# EAGLE design altimeter (EAGLE 7.6.0)
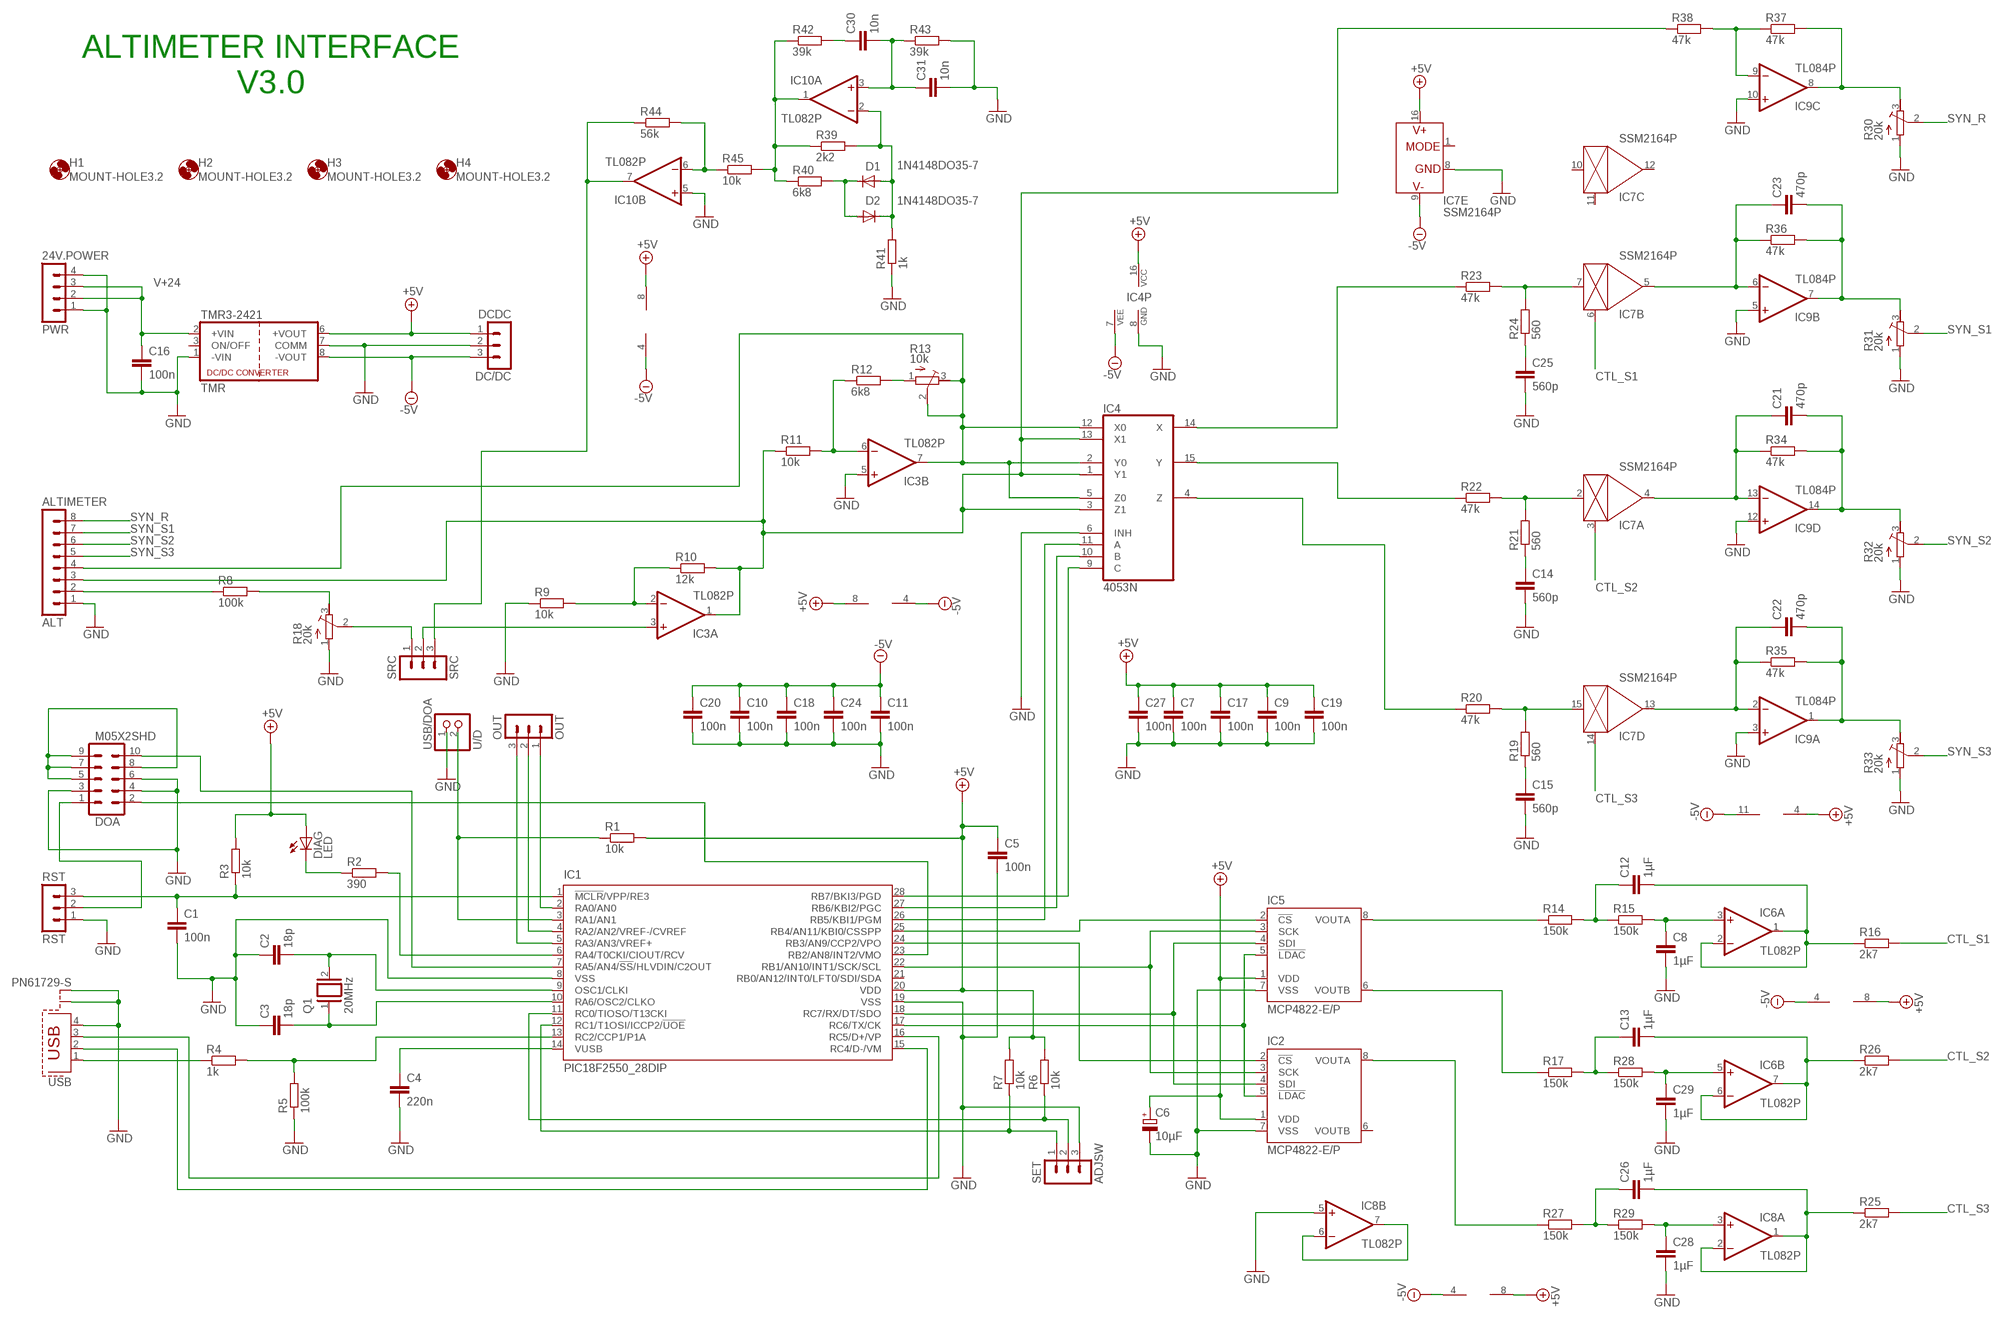
[diagram p0: schematic, sheet 1]

## Parts
24V.POWER  PWR  MA04-1  [MA04-1]
ADJSW  SET  MA03-1  [MA03-1]
ALTIMETER  ALT  MA08-1  [MA08-1]
C1  100n  C-EU025-025X050  [C025-025X050]
C2  18p  C-EU025-025X050  [C025-025X050]
C3  18p  C-EU025-025X050  [C025-025X050]
C4  220n  C5/3  [C5B3]
C5  100n  C-EU025-025X050  [C025-025X050]
C6  10µF  CPOL-EUE2.5-5  [E2,5-5]
C7  100n  C-EU025-025X050  [C025-025X050]
C8  1µF  C-EU025-025X050  [C025-025X050]
C9  100n  C-EU025-025X050  [C025-025X050]
C10  100n  C-EU025-025X050  [C025-025X050]
C11  100n  C-EU025-025X050  [C025-025X050]
C12  1µF  C-EU025-025X050  [C025-025X050]
C13  1µF  C-EU025-025X050  [C025-025X050]
C14  560p  C-EU025-025X050  [C025-025X050]
C15  560p  C-EU025-025X050  [C025-025X050]
C16  100n  C-EU025-025X050  [C025-025X050]
C17  100n  C-EU025-025X050  [C025-025X050]
C18  100n  C-EU025-025X050  [C025-025X050]
C19  100n  C-EU025-025X050  [C025-025X050]
C20  100n  C-EU025-025X050  [C025-025X050]
C21  470p  C-EU025-025X050  [C025-025X050]
C22  470p  C-EU025-025X050  [C025-025X050]
C23  470p  C-EU025-025X050  [C025-025X050]
C24  100n  C-EU025-025X050  [C025-025X050]
C25  560p  C-EU025-025X050  [C025-025X050]
C26  1µF  C-EU025-025X050  [C025-025X050]
C27  100n  C-EU025-025X050  [C025-025X050]
C28  1µF  C-EU025-025X050  [C025-025X050]
C29  1µF  C-EU025-025X050  [C025-025X050]
C30  10n  C-EU025-025X050  [C025-025X050]
C31  10n  C-EU025-025X050  [C025-025X050]
D1  1N4148DO35-7  [DO35-7]
D2  1N4148DO35-7  [DO35-7]
DC/DC  DCDC  MA03-1  [MA03-1]
DIAG  LED  LED3MM  [LED3MM]
DOA  M05X2SHD  [2X5-SHROUDED]
H1  MOUNT-HOLE3.2  [3,2]
H2  MOUNT-HOLE3.2  [3,2]
H3  MOUNT-HOLE3.2  [3,2]
H4  MOUNT-HOLE3.2  [3,2]
IC1  PIC18F2550_28DIP  [DIL28-3]
IC2  MCP4822-E/P  [DIL08]
IC3  TL082P  [DIL08]
IC4  4053N  [DIL16]
IC5  MCP4822-E/P  [DIL08]
IC6  TL082P  [DIL08]
IC7  SSM2164P  [DIL16]
IC8  TL082P  [DIL08]
IC9  TL084P  [DIL14]
IC10  TL082P  [DIL08]
OUT  OUT  MA03-1  [MA03-1]
Q1  20MHz  XTAL/S  [QS]
R1  10k  R-EU_0204/7  [0204/7]
R2  390  R-EU_0204/7  [0204/7]
R3  10k  R-EU_0204/7  [0204/7]
R4  1k  R-EU_0204/7  [0204/7]
R5  100k  R-EU_0204/7  [0204/7]
R6  10k  R-EU_0204/7  [0204/7]
R7  10k  R-EU_0204/7  [0204/7]
R8  100k  R-EU_0204/7  [0204/7]
R9  10k  R-EU_0204/7  [0204/7]
R10  12k  R-EU_0204/7  [0204/7]
R11  10k  R-EU_0204/7  [0204/7]
R12  6k8  R-EU_0204/7  [0204/7]
R13  10k  R-TRIMM64Z  [RTRIM64Z]
R14  150k  R-EU_0204/7  [0204/7]
R15  150k  R-EU_0204/7  [0204/7]
R16  2k7  R-EU_0204/7  [0204/7]
R17  150k  R-EU_0204/7  [0204/7]
R18  20k  R-TRIMM64Z  [RTRIM64Z]
R19  560  R-EU_0204/7  [0204/7]
R20  47k  R-EU_0204/7  [0204/7]
R21  560  R-EU_0204/7  [0204/7]
R22  47k  R-EU_0204/7  [0204/7]
R23  47k  R-EU_0204/7  [0204/7]
R24  560  R-EU_0204/7  [0204/7]
R25  2k7  R-EU_0204/7  [0204/7]
R26  2k7  R-EU_0204/7  [0204/7]
R27  150k  R-EU_0204/7  [0204/7]
R28  150k  R-EU_0204/7  [0204/7]
R29  150k  R-EU_0204/7  [0204/7]
R30  20k  R-TRIMM64Z  [RTRIM64Z]
R31  20k  R-TRIMM64Z  [RTRIM64Z]
R32  20k  R-TRIMM64Z  [RTRIM64Z]
R33  20k  R-TRIMM64Z  [RTRIM64Z]
R34  47k  R-EU_0204/7  [0204/7]
R35  47k  R-EU_0204/7  [0204/7]
R36  47k  R-EU_0204/7  [0204/7]
R37  47k  R-EU_0204/7  [0204/7]
R38  47k  R-EU_0204/7  [0204/7]
R39  2k2  R-EU_0204/7  [0204/7]
R40  6k8  R-EU_0204/7  [0204/7]
R41  1k  R-EU_0204/7  [0204/7]
R42  39k  R-EU_0204/7  [0204/7]
R43  39k  R-EU_0204/7  [0204/7]
R44  56k  R-EU_0204/7  [0204/7]
R45  10k  R-EU_0204/7  [0204/7]
RST  RST  MA03-1  [MA03-1]
SRC  SRC  MA03-1  [MA03-1]
TMR3-2421  TMR  [TRACO_SIP-8]
USB  PN61729-S  [PN61729-S]
USB/DOA  U/D  PINHD-1X2  [1X02]

## Nets
+5V [+5V]: C5.1 C6.+ C7.1 C9.1 C17.1 C19.1 C27.1 DC/DC.1 DIAG.A IC1.20(VDD) IC2.1(VDD) IC3.8(P:V+) IC4.16(VCC) IC5.1(VDD) IC6.8(P:V+) IC7.16(E:V+) IC8.8(P:V+) IC9.4(P:V+) IC10.8(P:V+) R1.2 R3.2 R6.2 R7.2 TMR3-2421.6(+VOUT)
-5V [-5V]: C10.1 C11.1 C18.1 C20.1 C24.1 DC/DC.3 IC3.4(P:V-) IC4.7(VEE) IC6.4(P:V-) IC7.9(E:V-) IC8.4(P:V-) IC9.11(P:V-) IC10.4(P:V-) TMR3-2421.8(-VOUT)
CTL_S1: IC7.6(B:CTRL) R16.2
CTL_S2: IC7.3(A:CTRL) R26.2
CTL_S3: IC7.14(D:CTRL) R25.2
GND [ground]: 24V.POWER.1 24V.POWER.4 ADJSW.3 ALTIMETER.1 C1.2 C2.1 C3.1 C4.2 C5.2 C6.- C7.2 C8.2 C9.2 C10.2 C11.2 C14.2 C15.2 C16.2 C17.2 C18.2 C19.2 C20.2 C24.2 C25.2 C27.2 C28.2 C29.2 C31.2 DC/DC.2 DOA.3 DOA.4 DOA.6 IC1.8(VSS) IC1.19(VSS) IC2.7(VSS) IC3.5(B:+IN) IC4.6(INH) IC4.8(GND) IC5.7(VSS) IC7.8(E:GND) IC8.5(B:+IN) IC9.3(A:+IN) IC9.5(B:+IN) IC9.10(C:+IN) IC9.12(D:+IN) IC10.5(B:+IN) R5.1 R9.1 R18.1(A) R30.1(A) R31.1(A) R32.1(A) R33.1(A) R41.1 R43.2 RST.1 TMR3-2421.1(-VIN) TMR3-2421.7(COMM) USB.4 USB.S1 USB.S2 USB/DOA.1
MUX_A: IC1.26(RB5/KBI1/PGM) IC4.11(A)
MUX_B: IC1.27(RB6/KBI2/PGC) IC4.10(B)
MUX_C: IC1.28(RB7/BKI3/PGD) IC4.9(C)
N$1: ALTIMETER.2 R8.1
N$2: IC5.8(VOUTA) R14.1
N$3: IC9.8(C:OUT) R30.3(E) R37.2
N$4: R8.2 R18.3(E)
N$5: IC5.6(VOUTB) R17.1
N$7: ADJSW.1 IC1.12(RC1/T1OSI/ICCP2/!UOE) R7.1
N$8: IC1.24(RB3/AN9/CCP2/VPO) IC2.2(!CS)
N$9: R12.2 R13.1(A)
N$10: IC3.2(A:-IN) R9.2 R10.1
N$11: IC9.9(C:-IN) R37.1 R38.2
N$12: R18.2(S) SRC.1
N$13: IC3.3(A:+IN) SRC.2
N$14: ADJSW.2 IC1.11(RC0/TIOSO/T13CKI) R6.1
N$15: IC1.25(RB4/AN11/KBI0/CSSPP) IC5.2(!CS)
N$16: C30.1 R42.2
N$17: IC10.6(B:-IN) R44.2 R45.1
N$18: IC1.2(RA0/AN0) OUT.1
N$19: IC3.6(B:-IN) R11.2 R12.1
N$20: IC1.4(RA2/AN2/VREF-/CVREF) OUT.2
N$21: IC1.5(RA3/AN3/VREF+) OUT.3
N$22: IC10.7(B:OUT) R44.1 SRC.3
N$23: C12.2 IC6.1(A:OUT) IC6.2(A:-IN) R16.1
N$24: IC1.17(RC6/TX/CK) IC2.5(!LDAC) IC5.5(!LDAC)
N$25: IC1.18(RC7/RX/DT/SDO) IC2.4(SDI) IC5.4(SDI)
N$26: IC10.1(A:OUT) R39.1 R40.1 R42.1 R45.2
N$27: ALTIMETER.4 IC3.7(B:OUT) IC4.2(Y0) IC4.5(Z0) IC4.12(X0) R13.2(S) R13.3(E)
N$28: C8.1 IC6.3(A:+IN) R15.2
N$29: C30.2 C31.1 IC10.3(A:+IN) R43.1
N$30: D1.C D2.A R40.2
N$31: C12.1 R14.2 R15.1
N$32: D1.A D2.C IC10.2(A:-IN) R39.2 R41.2
N$33: IC7.7(B:IN) R23.2 R24.2
N$34: C26.2 IC8.1(A:OUT) IC8.2(A:-IN) R25.1
N$35: IC7.2(A:IN) R21.2 R22.2
N$36: C28.1 IC8.3(A:+IN) R29.2
N$37: IC7.15(D:IN) R19.2 R20.2
N$38: C25.1 R24.1
N$39: C14.1 R21.1
N$40: C15.1 R19.1
N$41: C13.2 IC6.6(B:-IN) IC6.7(B:OUT) R26.1
N$42: C13.1 R17.2 R28.1
N$43: IC1.22(RB1/AN10/INT1/SCK/SCL) IC2.3(SCK) IC5.3(SCK)
N$44: C29.1 IC6.5(B:+IN) R28.2
N$45: C26.1 R27.2 R29.1
N$46: IC2.8(VOUTA) R27.1
N$47: IC8.6(B:-IN) IC8.7(B:OUT)
N$51: C4.1 IC1.14(VUSB)
N$54: IC1.16(RC5/D+/VP) USB.3
N$55: C23.1 IC7.5(B:OUT) IC9.6(B:-IN) R36.1
N$56: C23.2 IC9.7(B:OUT) R31.3(E) R36.2
N$57: C21.1 IC7.4(A:OUT) IC9.13(D:-IN) R34.1
N$58: C21.2 IC9.14(D:OUT) R32.3(E) R34.2
N$59: C22.1 IC7.13(D:OUT) IC9.2(A:-IN) R35.1
N$60: C22.2 IC9.1(A:OUT) R33.3(E) R35.2
N$61: IC1.15(RC4/D-/VM) USB.2
N$62: R4.1 USB.1
N$63: IC1.13(RC2/CCP1/P1A) R4.2 R5.2
N$64: DOA.1 RST.2
N$65: C3.2 IC1.10(RA6/OSC2/CLKO) Q1.1
N$66: C2.2 IC1.9(OSC1/CLKI) Q1.2
N$67: C1.1 IC1.1(!MCLR!/VPP/RE3) R3.1 RST.3
N$71 [+5V]: DOA.5 DOA.7 DOA.8 DOA.9
N$72: DOA.2 IC1.23(RB2/AN8/INT2/VMO)
N$73: DIAG.K(C) R2.1
N$74: IC1.6(RA4/T0CKI/CIOUT/RCV) R2.2
N$75: DOA.10 IC1.7(RA5/AN4/!SS!/HLVDIN/C2OUT)
N$76: IC1.3(RA1/AN1) R1.1 USB/DOA.2
REF_S1: IC4.14(X) R23.1
REF_S2: IC4.15(Y) R22.1
REF_S3: IC4.4(Z) R20.1
SIN: ALTIMETER.3 IC3.1(A:OUT) IC4.1(Y1) IC4.3(Z1) IC4.13(X1) R10.2 R11.1 R38.1
SYN_R: ALTIMETER.8 R30.2(S)
SYN_S1: ALTIMETER.7 R31.2(S)
SYN_S2: ALTIMETER.6 R32.2(S)
SYN_S3: ALTIMETER.5 R33.2(S)
V+24 [V+24]: 24V.POWER.2 24V.POWER.3 C16.1 TMR3-2421.2(+VIN)
Unconnected: IC1.21(RB0/AN12/INT0/LFT0/SDI/SDA) IC2.6(VOUTB) IC7.1(E:MODE) IC7.10(C:IN) IC7.11(C:CTRL) IC7.12(C:OUT) TMR3-2421.3(ON/OFF)

## Notes on the sheet
- ALTIMETER INTERFACE
  V3.0

## Library data of the parts
24V.POWER = con-lstb:MA04-1: PIN HEADER; OC_FARNELL: unknown; OC_NEWARK: unknown
ADJSW DC/DC OUT RST SRC = con-lstb:MA03-1: PIN HEADER; OC_FARNELL: unknown; OC_NEWARK: unknown
ALTIMETER = con-lstb:MA08-1: PIN HEADER; OC_FARNELL: unknown; OC_NEWARK: unknown
C1-C3 C5 C7-C31 = rcl:C-EU: CAPACITOR, European symbol
C4 = capacitor-wima:C: CAPACITOR naming: grid - package width
C6 = rcl:CPOL-EU: POLARIZED CAPACITOR, European symbol
D1 D2 = diode:1N4148: DIODE high speed (Philips)
DIAG = henk:LED: LEDs Standard schematic elements and footprints for 5mm, 3mm, 1206, and 0603 sized LEDs. 5mm - Spark Fun Electronics SKU : COM-00529 (and others)
DOA = henk:M05X2: Header 5x2 Standard 10-pin dual row 0.1" header. Commonly used with AVR-ISP. Use with Spark Fun Electronics SKU: PRT-00778
H1-H4 = holes:MOUNT-HOLE: MOUNTING HOLE with drill center marker
IC1 = microchip:PIC18F2*_28: USB Microcontrollers with nanoWatt Technology High-Performance, Enhanced Flash, 28/40/44-Pin, Source: http://ww1.microchip.com/downloads/en/devicedoc/39632c.pdf; MF: MICROCHIP; MPN: PIC18F2550-I/SP; OC_FARNELL: 1523822; OC_NEWARK: 80K6054
IC2 IC5 = nh-ic:MCP4822: Microchip MCP4822 According to datasheet http://ww1.microchip.com/downloads/en/DeviceDoc/22249A.pdf. Created by Nils Hintze <n.hintze@elektronikpage.net>
IC3 IC6 IC8 IC10 = linear:TL082: OP AMP Data sheet <http://www.ti.com/lit/ds/symlink/tl084a . pdf>; DATA_SHEET: <a href="http://www.ti.com/lit/ds/symlink/tl084a.pdf"> Data sheet </a>
IC4 = 40xx:4053: Triple 2-channel ANALOG MULTIPLEXER
IC7 = ssm2164:SSM2164
IC9 = linear:TL084: OP AMP
Q1 = special:XTAL/S: CRYSTAL
R1-R12 R14-R17 R19-R29 R34-R45 = rcl:R-EU_: RESISTOR, European symbol
R13 R18 R30-R33 = resistor:R-TRIMM: Trimm resistor
TMR3-2421 = traco-tmr-dual:TMR
USB = con-berg:PN61729-S: BERG USB connector; OC_FARNELL: unknown; OC_NEWARK: unknown
USB/DOA = pinhead:PINHD-1X2: PIN HEADER

## Net classes
0 default: width 0.254 mm, clearance 0.381 mm
1 ground: width 0.508 mm, clearance 0.381 mm
2 +5V: width 0.508 mm, clearance 0.381 mm
3 -5V: width 0.508 mm, clearance 0.381 mm
4 V-15: width 0.508 mm, clearance 0.381 mm
5 V+15: width 0.508 mm, clearance 0.381 mm
6 V+24: width 0.508 mm, clearance 0.381 mm

## Board
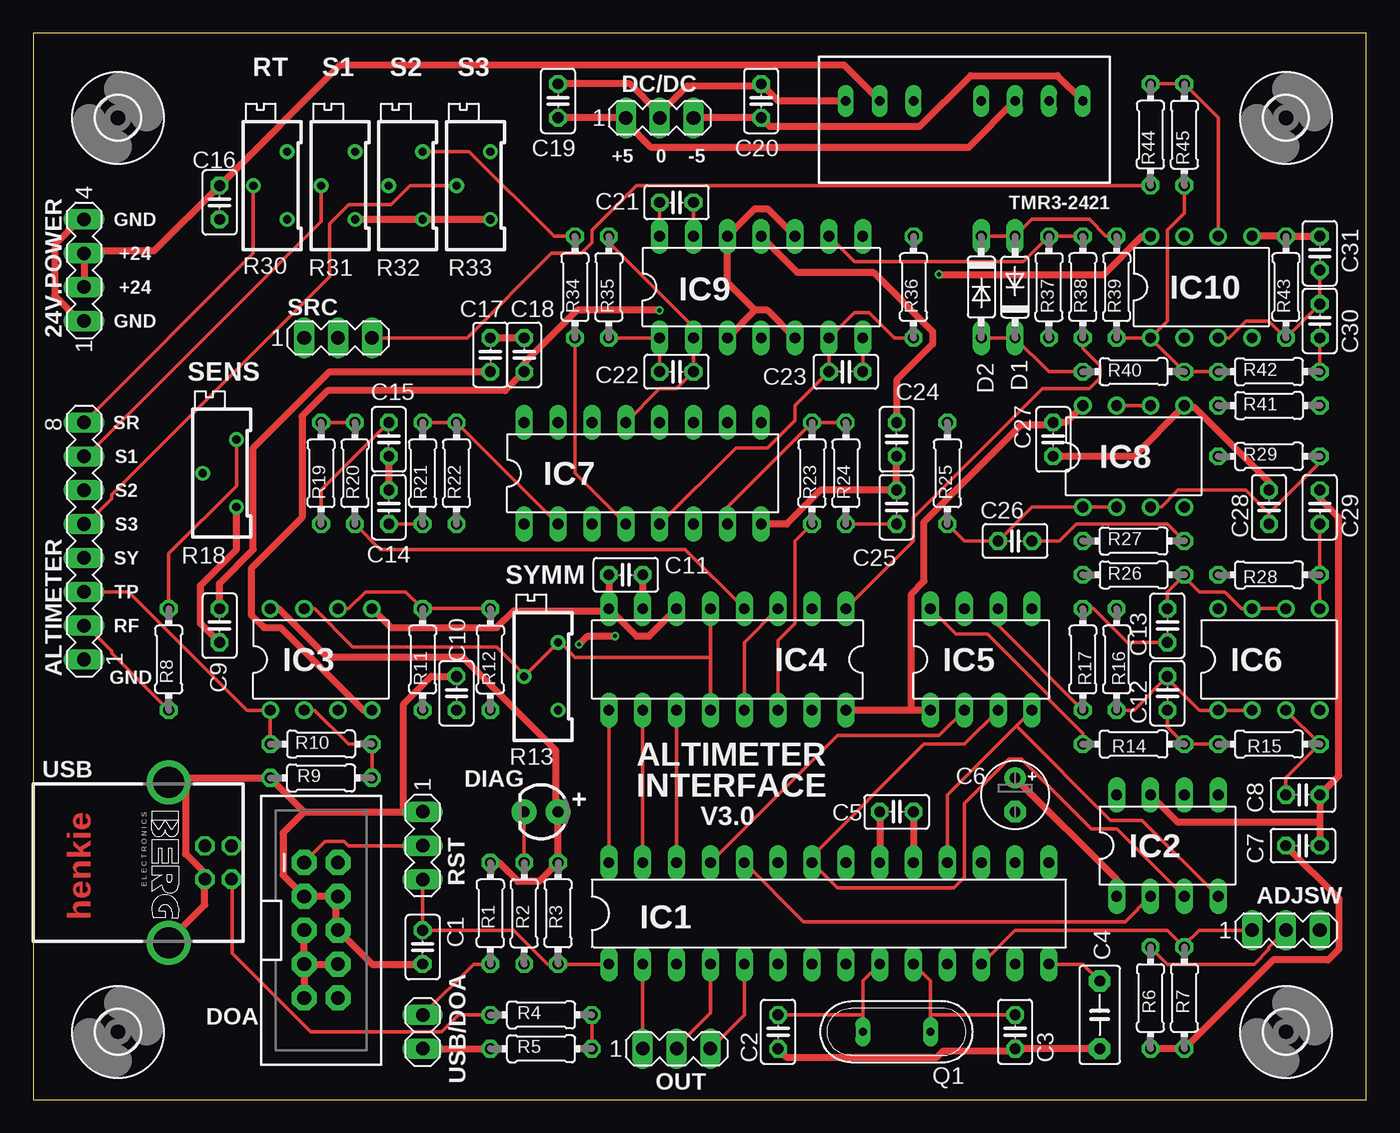
[diagram p1: board, top side]
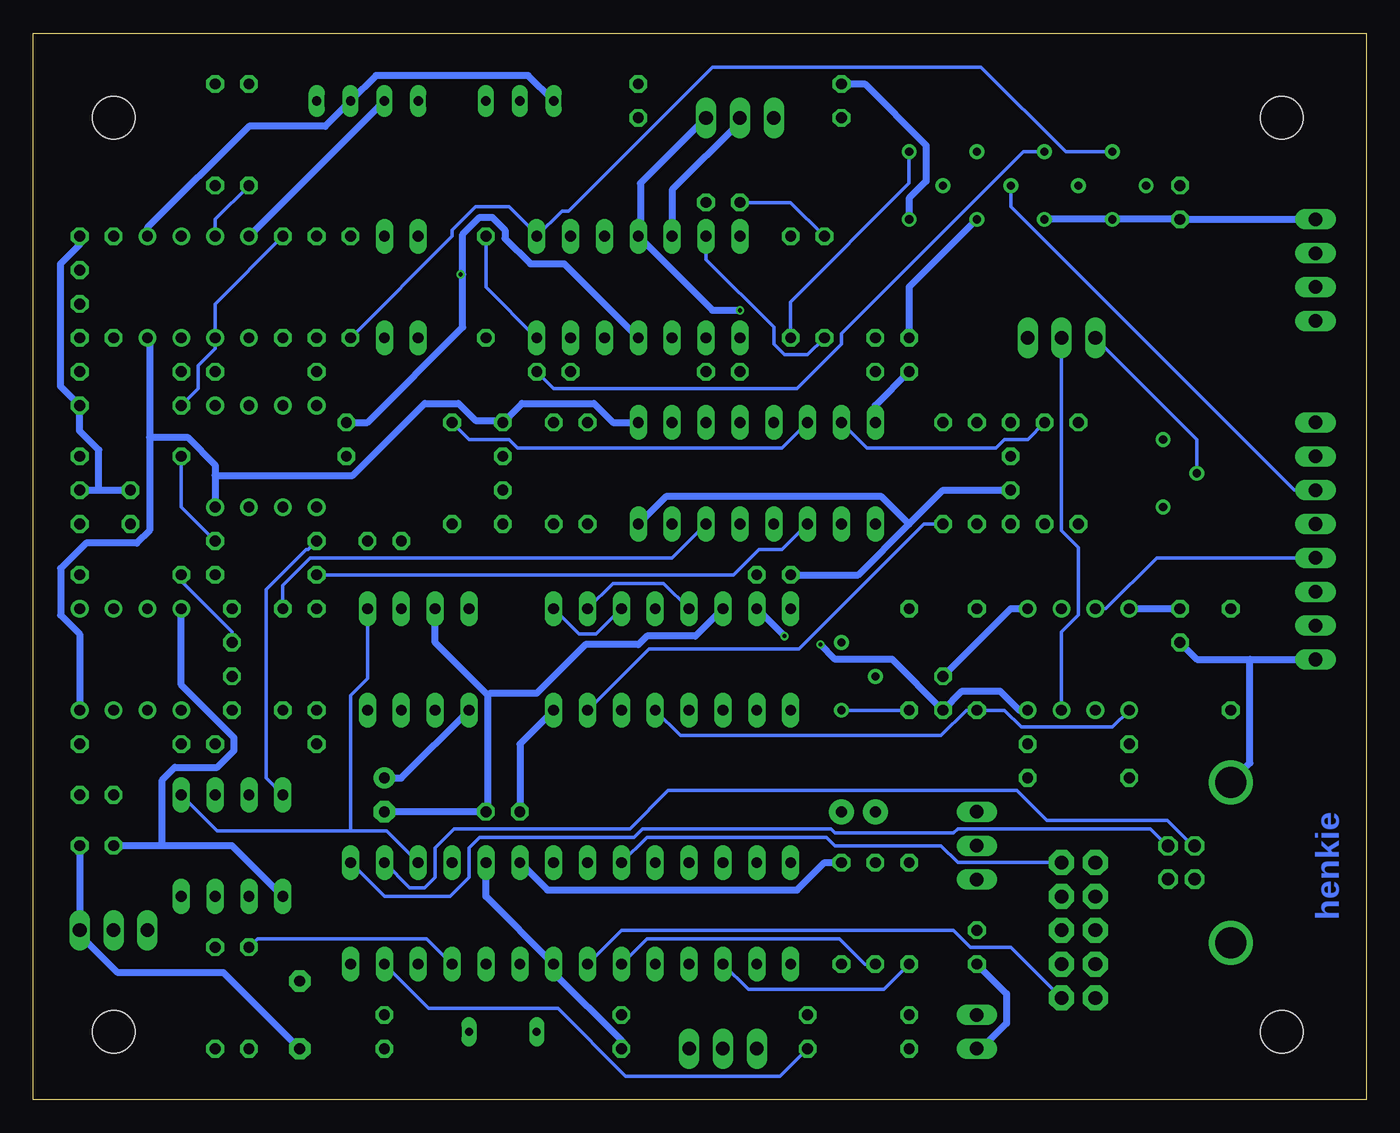
[diagram p2: board, bottom side, seen from below]

Size 100 x 80 mm. Coordinates in mm from the lower left corner, seen from the top.
Outline: 0,0 100,0 100,80 0,80 0,0
Copper layers (1*16): Top 0.035mm / dielectric 1.5mm / Bottom 0.035mm
Design rules "ITEADstudio_DRC": minimum track width 6mil, minimum drill 12mil, track to track 6mil, track to pad 6mil, pad to pad 6mil, via to via 6mil, smd to smd 0mil, copper to edge 10mil, drill to drill 10mil, minimum pad ring 10mil, minimum via ring 6mil, stop-mask expansion 2mil, vias tented up to drill 100mil, thermal gap 10mil

### Footprints (pad centres in the part's own frame; a part is rotated, then mirrored left to right if it is on the bottom)
MA04-1 = drill 1.016 long: 1 -3.81,0; 2 -1.27,0; 3 1.27,0; 4 3.81,0
MA03-1 = drill 1.016 long: 1 -2.54,0; 2 0,0; 3 2.54,0
MA08-1 = drill 1.016 long: 1 -8.89,0; 2 -6.35,0; 3 -3.81,0; 4 -1.27,0; 5 1.27,0; 6 3.81,0; 7 6.35,0; 8 8.89,0
C025-025X050 = drill 0.813 octagon: 1 -1.27,0; 2 1.27,0
C5B3 = drill 0.813 pad 1.6 octagon: 1 -2.54,0; 2 2.54,0
E2,5-5 = drill 0.813 pad 1.6: + -1.27,0 | drill 0.813 pad 1.6 octagon: - 1.27,0
DO35-7 = drill 0.813 long: A 3.81,0; C -3.81,0
LED3MM = drill 0.813 pad 1.88: A -1.27,0; K 1.27,0
2X5-SHROUDED = drill 1.016 pad 1.88 octagon: 1 -1.27,5.08; 2 1.27,5.08; 3 -1.27,2.54; 4 1.27,2.54; 5 -1.27,0; 6 1.27,0; 7 -1.27,-2.54; 8 1.27,-2.54; 9 -1.27,-5.08; 10 1.27,-5.08
3,2 = hole 3.2: 0,0
DIL28-3 = drill 0.813 long: 1 -16.51,-3.81; 2 -13.97,-3.81; 3 -11.43,-3.81; 4 -8.89,-3.81; 5 -6.35,-3.81; 6 -3.81,-3.81; 7 -1.27,-3.81; 8 1.27,-3.81; 9 3.81,-3.81; 10 6.35,-3.81; 11 8.89,-3.81; 12 11.43,-3.81; 13 13.97,-3.81; 14 16.51,-3.81; 15 16.51,3.81; 16 13.97,3.81; 17 11.43,3.81; 18 8.89,3.81; 19 6.35,3.81; 20 3.81,3.81; 21 1.27,3.81; 22 -1.27,3.81; 23 -3.81,3.81; 24 -6.35,3.81; 25 -8.89,3.81; 26 -11.43,3.81; 27 -13.97,3.81; 28 -16.51,3.81
DIL08 = drill 0.813 long: 1 -3.81,-3.81; 2 -1.27,-3.81; 3 1.27,-3.81; 4 3.81,-3.81; 5 3.81,3.81; 6 1.27,3.81; 7 -1.27,3.81; 8 -3.81,3.81
DIL08' = drill 0.813 pad 1.27: 1 -3.81,-3.81; 2 -1.27,-3.81; 3 1.27,-3.81; 4 3.81,-3.81; 5 3.81,3.81; 6 1.27,3.81; 7 -1.27,3.81; 8 -3.81,3.81
DIL16 = drill 0.813 long: 1 -8.89,-3.81; 2 -6.35,-3.81; 3 -3.81,-3.81; 4 -1.27,-3.81; 5 1.27,-3.81; 6 3.81,-3.81; 7 6.35,-3.81; 8 8.89,-3.81; 9 8.89,3.81; 10 6.35,3.81; 11 3.81,3.81; 12 1.27,3.81; 13 -1.27,3.81; 14 -3.81,3.81; 15 -6.35,3.81; 16 -8.89,3.81
DIL14 = drill 0.813 long: 1 -7.62,-3.81; 2 -5.08,-3.81; 3 -2.54,-3.81; 4 0,-3.81; 5 2.54,-3.81; 6 5.08,-3.81; 7 7.62,-3.81; 8 7.62,3.81; 9 5.08,3.81; 10 2.54,3.81; 11 0,3.81; 12 -2.54,3.81; 13 -5.08,3.81; 14 -7.62,3.81
QS = drill 0.61 long: 1 -2.54,0; 2 2.54,0
0204/7 = drill 0.813 octagon: 1 -3.81,0; 2 3.81,0
RTRIM64Z = drill 0.61: 1 0,-2.54; 2 -2.54,0; 3 0,2.54
TRACO_SIP-8 = drill 0.7 long: 1 -8.89,0; 2 -6.35,0; 3 -3.81,0; 5 1.27,0; 6 3.81,0; 7 6.35,0; 8 8.89,0
PN61729-S = drill 0.95 octagon: 1 1.25,4.71; 2 -1.25,4.71; 3 -1.25,2.71; 4 1.25,2.71 | drill 2.3 pad 2.9: S1 -6.02,0; S2 6.02,0
1X02 = drill 1.016 long: 1 -1.27,0; 2 1.27,0

### Placement (x,y rotation side)
24V.POWER  3.81,62.23 90 top
ADJSW  93.98,12.7 0 top
ALTIMETER  3.81,41.91 90 top
C1  29.21,11.43 270 top
C2  55.88,5.08 90 top
C3  73.66,5.08 90 top
C4  80.01,6.35 270 top
C5  64.77,21.59 0 top
C6  73.66,22.86 270 top
C7  95.25,19.05 0 top
C8  95.25,22.86 0 top
C9  13.97,35.56 270 top
C10  31.75,30.48 90 top
C11  44.45,39.37 180 top
C12  85.09,30.48 90 top
C13  85.09,35.56 90 top
C14  26.67,44.45 90 top
C15  26.67,49.53 270 top
C16  13.97,67.31 270 top
C17  34.29,55.88 90 top
C18  36.83,55.88 90 top
C19  39.37,74.93 90 top
C20  54.61,74.93 90 top
C21  48.26,67.31 180 top
C22  48.26,54.61 180 top
C23  60.96,54.61 0 top
C24  64.77,49.53 270 top
C25  64.77,44.45 90 top
C26  73.66,41.91 180 top
C27  76.52,49.53 270 top
C28  92.71,44.45 90 top
C29  96.52,44.45 90 top
C30  96.52,58.42 90 top
C31  96.52,63.5 90 top
D1  73.66,60.96 90 top
D2  71.12,60.96 270 top
DC/DC  46.99,73.66 0 top
DIAG  38.1,21.59 180 top
DOA  21.59,12.7 0 top
H1  6.35,73.66 0 top
H2  93.98,5.08 0 top
H3  6.35,5.08 0 top
H4  93.98,73.66 0 top
IC1  59.69,13.97 0 top
IC2  85.09,19.05 0 top
IC3  TL082P  [DIL08']  21.59,33.02 0 top
IC4  52.07,33.02 180 top
IC5  71.12,33.02 0 top
IC6  TL082P  [DIL08']  92.71,33.02 0 top
IC7  45.72,46.99 0 top
IC8  TL082P  [DIL08']  82.55,48.26 0 top
IC9  54.61,60.96 0 top
IC10  TL082P  [DIL08']  87.63,60.96 0 top
OUT  48.26,3.81 0 top
Q1  64.77,5.08 180 top
R1  34.29,13.97 90 top
R2  36.83,13.97 270 top
R3  39.37,13.97 90 top
R4  38.1,6.35 0 top
R5  38.1,3.81 0 top
R6  83.82,7.62 270 top
R7  86.36,7.62 270 top
R8  10.16,33.02 90 top
R9  21.59,24.13 0 top
R10  21.59,26.67 180 top
R11  29.21,33.02 90 top
R12  34.29,33.02 270 top
R13  39.37,31.75 0 top
R14  82.55,26.67 0 top
R15  92.71,26.67 0 top
R16  81.28,33.02 90 top
R17  78.74,33.02 90 top
R18  15.24,46.99 0 top
R19  21.59,46.99 90 top
R20  24.13,46.99 90 top
R21  29.21,46.99 90 top
R22  31.75,46.99 90 top
R23  58.42,46.99 90 top
R24  60.96,46.99 90 top
R25  68.58,46.99 90 top
R26  82.55,39.37 180 top
R27  82.55,41.91 0 top
R28  92.71,39.37 0 top
R29  92.71,48.26 0 top
R30  19.05,68.58 0 top
R31  24.13,68.58 0 top
R32  29.21,68.58 0 top
R33  34.29,68.58 0 top
R34  40.64,60.96 90 top
R35  43.18,60.96 270 top
R36  66.04,60.96 90 top
R37  76.2,60.96 270 top
R38  78.74,60.96 90 top
R39  81.28,60.96 90 top
R40  82.55,54.61 180 top
R41  92.71,52.07 180 top
R42  92.71,54.61 0 top
R43  93.98,60.96 90 top
R44  83.82,72.39 90 top
R45  86.36,72.39 270 top
RST  29.21,19.05 270 top
SRC  22.86,57.15 0 top
TMR3-2421  69.85,74.93 0 top
USB  10.16,17.78 270 top
USB/DOA  29.21,5.08 90 top

### Tracks (layer width: path | path; a pad name or v marks a point on that pad's centre or on a via)
+5V  (via drill 0.3)
  Top 0.508: R1.2 34.92,17.78 36.35,16.35 37.94,16.35 R3.2 DIAG.A 39.21,21.75 39.21,26.19 32.23,33.18 22.07,33.18 18.41,36.83 IC3.8 | C17.1 22.23,54.61 16.51,48.9 16.51,41.27 13.97,38.73 C9.1 | C19.1 DC/DC.1 44.61,73.5 44.61,73.18 46.35,71.44 70.17,71.44 TMR3-2421.6 | IC8.8 77.47,50.8 C27.1 76.36,50.64 74.14,50.64 66.83,43.34 66.83,38.89 65.88,37.94 65.88,29.21 | C5.1 IC1.20 | IC5.1 65.88,29.21 | 65.88,29.21 IC4.16 | R6.2 R7.2 93.03,10.48 97.16,10.48 97.95,11.27 97.95,15.08 C7.1 | IC2.1 81.28,16.51 C6.+ | IC10.8 83.19,64.77 80.33,61.91 v67.94,61.91
  Bottom 0.508: IC7.16 36.83,52.07 C17.1 | IC3.8 C9.1 | IC10.8 TMR3-2421.6 | IC9.4 60.17,62.71 62.71,62.71 64.61,64.61 64.61,65.25 65.56,66.2 66.52,66.2 67.79,64.93 67.79,61.91 | 67.79,61.91 67.79,57.94 74.93,50.8 C27.1 | C5.1 63.5,26.67 IC4.16 | 90.33,19.05 85.09,19.05 IC2.1 | 90.33,19.05 C7.1 | IC6.8 88.9,31.11 84.93,27.15 84.93,26.19 86.2,24.92 89.38,24.92 90.33,23.97 90.33,19.05 | IC5.1 72.39,24.13 C6.+ | v67.94,61.91 67.79,61.91 | R3.2 40.64,17.78 42.7,15.72 61.44,15.72 IC1.20
-5V  (via drill 0.3)
  Top 0.508: C11.1 IC4.7 | v43.66,34.77 41.59,34.77 v40.96,34.13 | v46.99,59.21 40.8,59.21 36.83,55.24 C18.1 35.4,53.18 22.07,53.18 20.16,51.28 20.16,43.66 16.35,39.85 16.35,36.35 17.3,35.4 18.57,35.4 24.77,29.21 IC3.4 | TMR3-2421.8 76.83,76.83 70.33,76.83 66.52,73.03 55.24,73.03 C20.1 DC/DC.3 | C24.1 64.77,53.98 67.47,56.67 67.47,57.63 63.02,62.07 57.31,62.07 IC9.11
  Bottom 0.508: IC7.9 56.52,50.8 57.94,52.23 63.34,52.23 C24.1 64.93,50.96 66.83,50.96 68.1,52.23 70.64,52.23 76.04,46.83 86.36,46.83 | IC6.4 96.52,34.92 97.95,36.35 97.95,39.85 96.04,41.75 92.23,41.75 91.28,42.7 91.28,49.69 | 91.28,49.69 91.28,56.99 IC10.4 | 86.36,46.83 86.36,47.62 88.42,49.69 91.28,49.69 | 86.36,46.83 IC8.4 | IC3.4 26.04,29.21 27.46,30.64 30.32,30.64 C10.1 35.56,33.02 39.85,33.02 v40.96,34.13 | v43.66,34.77 IC4.7 | v46.99,59.21 49.05,59.21 IC9.11 54.45,64.93 54.45,68.74 DC/DC.3
CTL_S1
  Bottom 0.254: R16.2 81.28,38.58 79.22,40.64 52.07,40.64 IC7.6
CTL_S2
  Bottom 0.254: R26.2 47.47,39.37 45.56,41.27 43.81,41.27 IC7.3
CTL_S3
  Bottom 0.254: IC7.14 43.81,48.9 63.66,48.9 64.29,49.53 67.31,49.53 R25.2
GND
  Top 0.508: 24V.POWER.1 3.49,58.42 1.59,60.33 1.59,64.14 3.49,66.04 24V.POWER.4 | C18.2 C17.2 | R31.1 R32.1 R33.1 | C27.2 82.55,48.26 IC8.5 86.52,51.91 87.15,51.91 92.71,46.35 C28.2 | IC10.5 R43.2 C31.2 | 54.13,59.21 IC9.3 | 54.13,59.21 55.09,59.21 IC9.5 | 54.13,59.21 52.07,61.28 IC9.12 54.13,66.83 55.09,66.83 IC9.10 | C19.2 44.77,76.2 46.99,73.98 DC/DC.2 47.15,74.14 49.05,76.04 54.45,76.04 C20.2 55.88,74.93 TMR3-2421.1 | C5.2 IC1.19 | 96.52,20.8 C8.2 97.95,24.29 97.95,43.66 96.52,45.09 C29.2 | 96.52,20.8 C7.2 | IC2.7 85.88,20.8 96.52,20.8 | C4.2 C3.1 73.5,3.65 68.26,3.65 67.79,3.17 56.52,3.17 C2.1 | IC7.8 56.52,43.18 59.05,45.72 C25.2 C24.2 | C15.2 C14.2 | C11.2 IC4.8 | IC4.6 46.2,34.77 45.24,34.77 IC4.8 | USB/DOA.1 R5.1 | C1.2 25.4,10.16 DOA.6 22.7,12.86 22.7,15.08 DOA.4 DOA.3 18.73,16.83 18.73,20 20.32,21.59 | R18.1 15.24,41.27 12.54,38.58 12.54,35.72 C9.2 | USB.S2 10.16,11.91 12.86,14.61 12.86,16.51 USB.4 12.7,16.67 12.7,17.14 11.43,18.41 11.43,23.97 USB.S1 10.16,23.81 10.48,24.13 R9.1 20.32,21.59 | 20.32,21.59 RST.1 27.78,21.75 27.78,29.69 29.84,31.75 C10.2 | IC3.5 26.83,35.4 34.77,35.4 36.04,36.67 43.02,36.67 IC4.8
  Bottom 0.508: R31.1 R30.1 C16.2 24V.POWER.4 | C17.2 34.29,60.96 R32.1 | C29.2 95.09,45.72 | 95.09,45.72 C28.2 | 95.09,45.72 95.09,48.74 96.52,50.16 R41.1 97.95,53.5 97.95,62.71 96.52,64.14 C31.2 | TMR3-2421.1 62.87,76.83 74.3,76.83 TMR3-2421.7 78.11,73.03 83.82,73.03 91.44,65.41 IC10.5 | IC9.12 52.07,68.26 46.99,73.34 DC/DC.2 | R33.1 34.29,67.63 33.02,68.9 33.02,71.6 37.62,76.2 C19.2 | IC5.7 69.85,34.29 65.88,30.32 | 65.88,30.32 65.88,21.75 C5.2 C6.- | C7.2 ADJSW.3 96.36,12.54 96.36,12.22 93.66,9.53 85.72,9.53 C4.2 | C2.1 55.88,4.45 60.96,9.53 IC1.8 66.04,15.24 IC1.19 | C14.2 31.75,45.72 34.29,43.18 | 34.29,43.18 38.1,39.37 C11.2 | IC7.8 52.55,45.24 36.35,45.24 34.29,43.18 | USB/DOA.1 28.89,3.81 26.99,5.71 26.99,7.94 C1.2 | 8.73,33.02 12.7,33.02 C9.2 | 8.73,33.02 ALTIMETER.1 | IC3.5 26.67,36.83 C10.2 | 8.73,33.02 8.73,25.24 10.16,23.81 USB.S1 | IC4.6 50.32,34.77 53.98,34.77 54.61,34.13 58.58,34.13 62.23,30.48 65.72,30.48 65.88,30.32
MUX_A
  Top 0.254: IC4.11 IC1.26
MUX_B
  Top 0.254: IC4.10 IC1.27
MUX_C
  Top 0.254: IC4.9 IC1.28
N$1
  Top 0.254: R8.1 5.87,33.5 5.87,33.66 3.97,35.56 ALTIMETER.2
N$2
  Top 0.254: R14.1 78.74,27.46 76.2,30 76.2,30.32 71.6,34.92 69.22,34.92 IC5.8
N$3
  Bottom 0.254: R30.3 22.54,71.12 28.89,77.47 49.05,77.47 59.85,66.67 60.33,66.67 IC9.8 62.23,64.93 64.29,66.99 66.83,66.99 68.58,65.25 68.58,64.77 R37.2
N$4
  Top 0.254: R18.3 15.24,46.04 10.16,40.96 R8.2
N$5
  Top 0.254: IC5.6 72.39,35.56 R17.1
N$7
  Top 0.254: IC1.12 73.66,12.7 85.09,12.7 R7.1 86.36,11.59 87.47,12.7 ADJSW.1
N$8
  Top 0.254: IC2.2 81.92,13.34 57.78,13.34 IC1.24
N$9
  Bottom 0.254: R12.2 R13.1
N$10
  Top 0.254: R9.2 R10.1 23.65,26.67 21.11,29.21 IC3.2
N$11
  Top 0.254: IC9.9 61.59,62.87 74.3,62.87 R37.1 R38.2
N$12
  Bottom 0.254: R18.2 12.7,49.53 SRC.1
N$13
  Bottom 0.254: IC3.3 22.86,35.08 21.59,36.35 21.59,41.43 22.86,42.7 SRC.2
N$14
  Top 0.254: ADJSW.2 92.71,11.43 92.71,11.27 91.6,10.16 85.09,10.16 R6.1
  Bottom 0.254: IC1.11 70.48,12.06 83.19,12.06 R6.1
N$15
  Top 0.254: IC1.25 60.33,27.3 67.94,27.3 IC5.2
N$16
  Top 0.254: C30.1 R42.2
N$17
  Top 0.254: R44.2 R45.1 88.9,73.66 IC10.6
N$18
  Top 0.254: OUT.1 IC1.2
N$19
  Top 0.254: IC3.6 23.65,36.83 24.92,38.1 27.94,38.1 R11.2 R12.1
N$20
  Top 0.254: IC1.4 50.8,6.51 48.26,3.97 OUT.2
N$21
  Top 0.254: IC1.5 53.34,6.35 OUT.3
N$22
  Top 0.254: SRC.3 32.54,57.15 38.89,63.5 41.12,63.5 41.91,64.29 41.91,65.25 45.24,68.58 R44.1
  Bottom 0.254: IC10.7 86.36,66.04 R44.1
N$23
  Top 0.254: IC6.2 IC6.1 87.47,29.21 85.09,31.59 C12.2 82.55,29.21 R16.1
N$24
  Bottom 0.254: IC1.17 73.5,20.16 76.2,20.16 | 76.2,20.16 86.2,20.16 IC2.5 | IC5.5 74.93,31.59 76.2,30.32 76.2,20.16
N$25
  Top 0.254: IC1.18 68.58,22.86 73.74,28.02 | IC5.4 73.74,28.02 | IC2.4 83.19,20.95 80.8,20.95 73.74,28.02
N$26
  Top 0.254: R42.1 R40.1 IC10.1 | IC10.1 R39.1 | R45.2 86.36,66.52 85.09,65.25 85.09,58.42 IC10.1
N$27
  Top 0.254: IC4.5 50.8,33.18 | 50.8,33.18 IC4.12 | 50.8,33.18 40.64,33.18 39.69,34.13 39.37,34.13 R13.3 R13.2 36.83,31.91 34.77,33.97 23.97,33.97 21.11,36.83 IC3.7
  Bottom 0.254: IC3.7 19.53,36.83 15.72,40.64 ALTIMETER.4 | IC4.2 56.52,38.73 52.7,38.73 IC4.5
N$28
  Top 0.254: C8.1 93.98,24.13 R15.2 IC6.3
N$29
  Top 0.254: C31.1 C30.2 R43.1 92.71,58.42 90.96,58.42 89.69,57.15 IC10.3
N$30
  Top 0.254: D2.A D1.C 76.2,54.61 R40.2
N$31
  Top 0.254: R15.1 R14.2 85.09,27.94 C12.1
N$32
  Top 0.254: D2.C D1.A 74.93,66.04 79.22,66.04 80.49,64.77 R39.2
  Bottom 0.254: R41.2 87.63,53.34 87.63,55.09 86.36,56.36 IC10.2 86.36,59.69 R39.2
N$33
  Top 0.254: IC7.7 52.07,44.45 R23.2 R24.2
N$34
  Top 0.254: IC8.2 IC8.1 74.93,44.45 C26.2 69.85,41.91 R25.1
N$35
  Top 0.254: IC7.2 R22.2 R21.2
N$36
  Top 0.254: 92.71,43.97 C28.1 | 92.71,43.97 96.52,47.78 R29.2 | IC8.3 84.61,44.45 85.88,45.72 90.96,45.72 92.71,43.97
N$37
  Top 0.254: R20.2 R19.2
  Bottom 0.254: IC7.15 37.47,48.9 27.78,48.9 27.15,49.53 25.4,49.53 R20.2
N$38
  Top 0.254: C25.1 R24.1
N$39
  Top 0.254: R21.1 C14.1
N$40
  Top 0.254: R19.1 21.59,45.72 C15.1
N$41
  Top 0.254: IC6.6 IC6.7 90.65,36.83 89.38,38.1 87.47,38.1 86.36,39.21 R26.1 85.09,38.1 C13.2
N$42
  Top 0.254: R17.2 79.53,36.83 82.07,34.29 C13.1
  Bottom 0.254: C13.1 85.09,35.08 88.9,38.89 R28.1
N$43
  Top 0.254: IC5.3 69.85,26.67 66.83,26.67 58.42,18.26 IC1.22 60.33,15.88 69.06,15.88 69.85,16.67 69.85,22.23 73.18,25.56 74.14,25.56 79.38,20.32 81.28,20.32 IC2.3
N$44
  Top 0.254: IC6.5 R28.2 C29.1
N$45
  Top 0.254: C26.1 76.99,41.91 78.26,43.18 85.09,43.18 R27.2
  Bottom 0.254: R29.1 88.9,44.45 R27.2
N$46
  Bottom 0.254: R27.1 79.38,41.27 79.53,41.27 82.55,38.26 82.55,24.13 IC2.8
N$47
  Top 0.254: IC8.6 IC8.7
N$51
  Top 0.254: IC1.14 78.74,10.16 C4.1
N$54
  Bottom 0.254: IC1.16 71.75,15.88 70.64,15.88 69.85,16.67 69.85,18.89 68.42,20.32 55.24,20.32 52.39,23.18 26.19,23.18 23.97,20.95 14.92,20.95 13.02,19.05 USB.3
N$55
  Top 0.254: IC7.5 52.7,48.9 55.09,48.9 57.15,50.96 57.15,52.07 C23.1 IC9.6 61.59,59.05 62.71,59.05 64.61,57.15 R36.1
N$56
  Top 0.254: C23.2 IC9.7
  Bottom 0.254: R31.3 25.72,71.12 39.37,57.47 39.37,56.67 42.7,53.34 60.96,53.34 C23.2 | R36.2 66.04,60.96 IC9.7
N$57
  Top 0.254: C21.1 IC9.13 | R34.1 40.64,46.99 IC7.4
  Bottom 0.254: IC9.13 49.53,63.02 44.45,57.94 44.45,56.67 43.66,55.88 41.91,55.88 R34.1
N$58
  Top 0.254: C21.2 IC9.14 | R32.3 32.7,71.12 39.05,64.77 R34.2
  Bottom 0.254: C21.2 43.18,67.31 R34.2
N$59
  Top 0.254: IC7.13 46.99,53.34 48.26,53.34 C22.1 IC9.2 49.53,57.94 43.18,64.29 R35.1
N$60
  Top 0.254: C22.2 IC9.1 R35.2
  Bottom 0.254: R33.3 34.29,68.74 43.18,59.85 R35.2
N$61
  Bottom 0.254: IC1.15 73.66,15.24 68.74,15.24 67.31,16.67 67.31,18.89 66.52,19.68 54.93,19.68 54.29,20.32 40.16,20.32 39.85,20 30.96,20 30.64,20.32 16.19,20.32 14.92,19.05 USB.2
N$62
  Top 0.254: R4.1 31.91,6.35 30.64,5.08 20.8,5.08 14.92,10.95 14.92,16.51 USB.1
N$63
  Top 0.254: R4.2 R5.2
  Bottom 0.254: IC1.13 70.33,6.83 60.64,6.83 55.56,1.75 43.97,1.75 R5.2
N$64
  Top 0.254: RST.2 23.65,19.05 23.34,19.37 21.91,19.37 DOA.1
N$65
  Top 0.254: 67.31,6.35 67.31,8.89 IC1.10 | 67.31,6.35 Q1.1 | 67.31,6.35 C3.2
N$66
  Top 0.254: 62.23,6.35 62.23,8.89 IC1.9 | 62.23,6.35 Q1.2 | 62.23,6.35 C2.2
N$67
  Top 0.254: IC1.1 R3.1 38.58,10.16 36.04,12.7 C1.1 RST.3
N$71
  Top 0.508: DOA.7 DOA.9 | DOA.7 DOA.8 | DOA.7 DOA.5
N$72
  Bottom 0.254: IC1.23 53.98,19.68 40.48,19.68 39.85,19.05 31.91,19.05 30.64,17.78 DOA.2
N$73
  Top 0.254: DIAG.K R2.1
N$74
  Bottom 0.254: R2.2 37.62,10.16 39.53,12.06 53.98,12.06 IC1.6
N$75
  Bottom 0.254: IC1.7 55.88,12.7 30.96,12.7 29.69,11.43 26.67,11.43 DOA.10
N$76
  Top 0.254: R1.1 33.02,10.16 USB/DOA.2
  Bottom 0.254: IC1.3 46.35,8.26 36.2,8.26 R1.1
REF_S1
  Top 0.254: IC4.14 55.88,34.45 57.15,35.72 57.15,41.91 R23.1
REF_S2
  Bottom 0.254: IC4.15 53.82,33.81 42.55,33.81 33.18,43.18 R22.1
REF_S3
  Top 0.254: IC4.4 48.9,41.27 26.04,41.27 R20.1
SIN
  Top 0.254: R10.2 IC3.1 16.03,29.21 7.14,38.1 ALTIMETER.3 | IC4.13 53.34,34.29 IC4.3 | R38.1 78.74,56.36 80.01,55.09 80.01,54.13 79.22,53.34 75.72,53.34 66.04,43.66 66.04,41.91 IC4.1
  Bottom 0.254: IC3.1 19.05,27.94 25.88,27.94 27.15,29.21 R11.1 30,29.21 31.91,27.3 51.44,27.3 IC4.13 | IC4.1 59.05,34.92 57.78,34.92 IC4.3
SYN_R
  Top 0.254: R30.2 16.51,63.5 ALTIMETER.8
SYN_S1
  Top 0.254: R31.2 21.59,65.88 3.97,48.26 ALTIMETER.7
SYN_S2
  Bottom 0.254: R32.2 26.67,66.99 5.4,45.72 ALTIMETER.6
SYN_S3
  Top 0.254: R33.2 28.26,68.58 26.83,67.15 23.65,67.15 22.23,65.72 22.23,61.75 5.87,45.4 5.87,45.09 3.97,43.18 ALTIMETER.5
V+24
  Top 0.508: 24V.POWER.2 24V.POWER.3 3.97,63.66 9.05,63.66 C16.1 23.02,77.63 60.8,77.63 TMR3-2421.2

### Text on the board
Top: henkie
Bottom: henkie
tNames: RT | S1 | S2 | S3 | +5 | 0 | -5 | TMR3-2421 | GND | +24 | +24 | GND | SENS | SR | S1 | S2 | S3 | SY | SYMM | TP | RF | GND | ALTIMETER / INTERFACE | + | V3.0